# EAGLE design PCB-ENCODERSOLO_EM (EAGLE 7.7.0)
SKAARHOJ 2012 Rotary Encoder Breakout Board
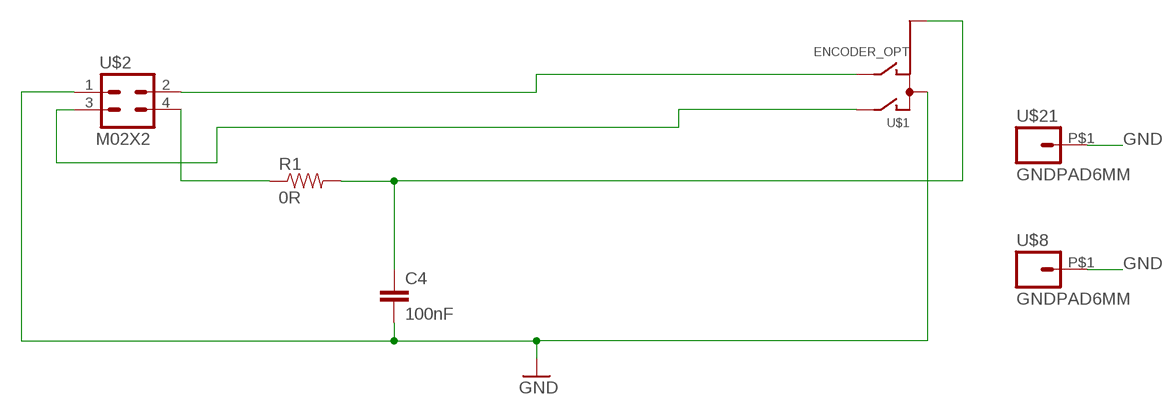
[diagram p0: schematic, sheet 1]

## Parts
C4  100nF  CAP0603-CAP  [0603-CAP]
R1  0R  RESISTOR0603-RES  [0603-RES]
U$1  ENCODER_OPT  [ENCODER_EM14]
U$2  M02X2  [2X2]
U$8  GNDPAD6MM  [3.2MMPAD6MM]
U$21  GNDPAD6MM  [3.2MMPAD6MM]

## Nets
5V [Power]: C4.1 R1.2 U$1.2(5V)
D3: U$1.5(A) U$2.3
GND [Power]: C4.2 U$1.6(GND) U$1.GND U$1.GND1(GND) U$2.1 U$8.P$1 U$21.P$1
N$1 [Power]: R1.1 U$2.4
N$124: U$1.1(B) U$2.2

## Library data of the parts
C4 = SparkFun:CAP: Capacitor Standard 0603 ceramic capacitor, and 0.1" leaded capacitor.
R1 = SparkFun:RESISTOR: Resistor Basic schematic elements and footprints for 0603, 1206, and PTH resistors.
U$1 = SKAARHOJ:ENCODER_OPT
U$2 = SKAARHOJ:M02X2
U$8 U$21 = SKAARHOJ:GNDPAD

## Net classes
0 default: width 0.203 mm, drill 0.406 mm, clearance 0.203 mm
1 Power: width 0.254 mm, drill 0.406 mm, clearance 0.254 mm

## Board
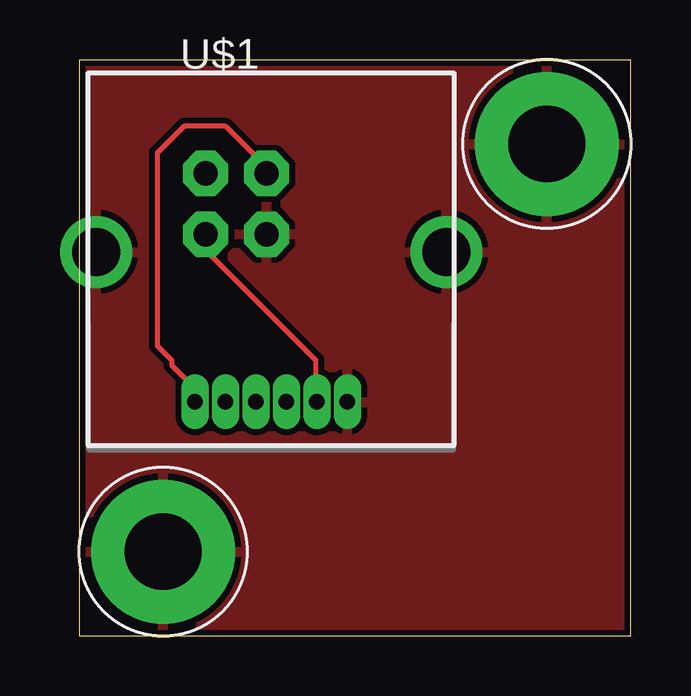
[diagram p1: board, top side]
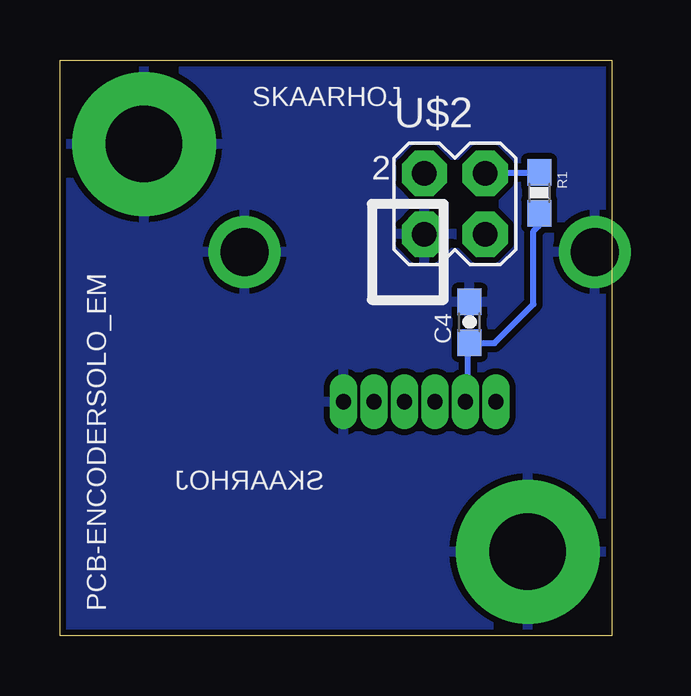
[diagram p2: board, bottom side, seen from below]

Size 23 x 24 mm. Coordinates in mm from the lower left corner, seen from the top.
Outline: 0,0 23,0 23,24 0,24 0,0
Copper layers (1*16): Top 0.035mm / dielectric 1.5mm / Bottom 0.035mm
Design rules "Fusion_eagle_rule_v1.1": minimum track width 6mil, minimum drill 12mil, track to track 6mil, track to pad 6mil, pad to pad 6mil, via to via 6mil, smd to smd 0mil, copper to edge 10mil, drill to drill 10mil, minimum pad ring 10mil, minimum via ring 6mil, stop-mask expansion 2mil, vias tented up to drill 100mil, thermal gap 10mil

### Footprints (pad centres in the part's own frame; a part is rotated, then mirrored left to right if it is on the bottom)
0603-CAP = smd 1.1 x 1: 1 -0.85,0; 2 0.85,0
0603-RES = smd 1.1 x 1: 1 -0.85,0; 2 0.85,0
ENCODER_EM14 = drill 0.64 pad 1.016 long: 1 -3.175,-6.25; 2 -1.905,-6.25; 3 -0.635,-6.25; 4 0.635,-6.25; 5 1.905,-6.25; 6 3.175,-6.25 | drill 2: GND -7.305,0; GND1 7.305,0
2X2 = drill 1.016 pad 1.88 octagon: 1 -3.81,-1.27; 2 -3.81,1.27; 3 -1.27,-1.27; 4 -1.27,1.27
3.2MMPAD6MM = drill 3.2 pad 6: P$1 0,0

### Placement (x,y rotation side)
C4  5.92,13.06 90 bottom
R1  3.02,18.46 270 bottom
U$1  8,16 0 top
U$2  4,18 0 bottom
U$8  19.5,20.5 0 top
U$21  3.5,3.5 0 top

### Tracks (layer width: path | path; a pad name or v marks a point on that pad's centre or on a via)
5V
  Bottom 0.254: U$1.2 5.99,9.75 5.99,12.19 C4.1 5.89,12.19 4.88,12.19 3.25,13.82 3.25,16.87 3.05,17.07 3.05,17.58 R1.2
D3
  Top 0.203: U$1.5 9.86,9.75 9.86,11.48 5.28,16.05 5.28,16.66 U$2.3
GND
  pour Top: 0,0 23,0 23,24 0,24
  pour Bottom: 0,0 23,0 23,24 0,24
N$1
  Bottom 0.254: R1.1 3.05,19.3 5.18,19.3 U$2.4
N$124
  Top 0.203: U$1.1 4.78,9.75 4.78,10.36 3.86,11.28 3.86,11.48 3.25,12.09 3.25,20.12 4.37,21.23 6.1,21.23 7.72,19.61 7.72,19.3 U$2.2

### Text on the board
_bsilk: SKAARHOJ | 2 | SKAARHOJ | PCB-ENCODERSOLO_EM